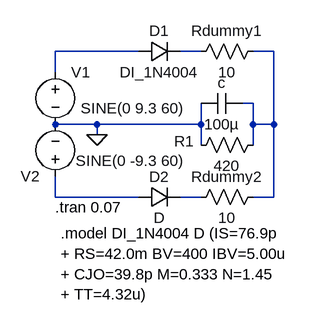
[diagram p0: schematic OndaCompleta RC.asc]
OndaCompleta RC.asc, the LTspice schematic file:
Version 4.1
SHEET 1 1284 680
WIRE 160 112 32 112
WIRE 256 112 224 112
WIRE 368 112 336 112
WIRE 32 144 32 112
WIRE 336 192 320 192
WIRE 96 224 32 224
WIRE 256 224 256 192
WIRE 256 224 96 224
WIRE 336 224 336 192
WIRE 368 224 368 112
WIRE 368 224 336 224
WIRE 96 240 96 224
WIRE 256 256 256 224
WIRE 336 256 336 224
WIRE 32 336 32 304
WIRE 160 336 32 336
WIRE 256 336 224 336
WIRE 368 336 368 224
WIRE 368 336 336 336
FLAG 96 240 0
SYMBOL voltage 32 128 R0
WINDOW 123 0 0 Left 0
WINDOW 39 0 0 Left 0
WINDOW 3 31 152 Left 2
SYMATTR Value SINE(0 -9.3 60)
SYMATTR InstName V1
SYMBOL res 352 96 R90
WINDOW 0 0 56 VBottom 2
WINDOW 3 32 56 VTop 2
SYMATTR InstName Rdummy1
SYMATTR Value 10
SYMBOL diode 160 128 R270
WINDOW 0 32 32 VTop 2
WINDOW 3 0 32 VBottom 2
SYMATTR InstName D1
SYMATTR Value DI_1N4004
SYMBOL voltage 32 320 R180
WINDOW 123 0 0 Left 0
WINDOW 39 0 0 Left 0
WINDOW 3 -199 121 Left 2
SYMATTR Value SINE(0 9.3 60)
SYMATTR InstName V2
SYMBOL res 352 240 R90
WINDOW 0 26 122 VBottom 2
WINDOW 3 32 56 VTop 2
SYMATTR InstName R1
SYMATTR Value 420
SYMBOL res 352 320 R90
WINDOW 0 0 56 VBottom 2
WINDOW 3 32 56 VTop 2
SYMATTR InstName Rdummy2
SYMATTR Value 10
SYMBOL diode 160 352 R270
WINDOW 0 32 32 VTop 2
WINDOW 3 0 32 VBottom 2
SYMATTR InstName D2
SYMBOL cap 320 176 R90
WINDOW 0 0 32 VBottom 2
WINDOW 3 32 32 VTop 2
SYMATTR InstName c
SYMATTR Value 100µ
TEXT 32 352 Left 2 !.tran 0.07
TEXT 40 392 Left 2 !.model DI_1N4004 D (IS=76.9p \n+ RS=42.0m BV=400 IBV=5.00u \n+ CJO=39.8p M=0.333 N=1.45 \n+ TT=4.32u)

The netlist it stands for:
* OndaCompleta RC.asc
V1 N001 0 SINE(0 -9.3 60)
Rdummy1 N003 N002 10
D1 N001 N002 DI_1N4004
V2 N004 0 SINE(0 9.3 60)
R1 N003 0 420
Rdummy2 N003 N005 10
D2 N004 N005 D
c N003 0 100µ
.model D D
.lib standard.dio
.tran 0.07
.model DI_1N4004 D (IS=76.9p
+ RS=42.0m BV=400 IBV=5.00u
+ CJO=39.8p M=0.333 N=1.45
+ TT=4.32u)
.backanno
.end